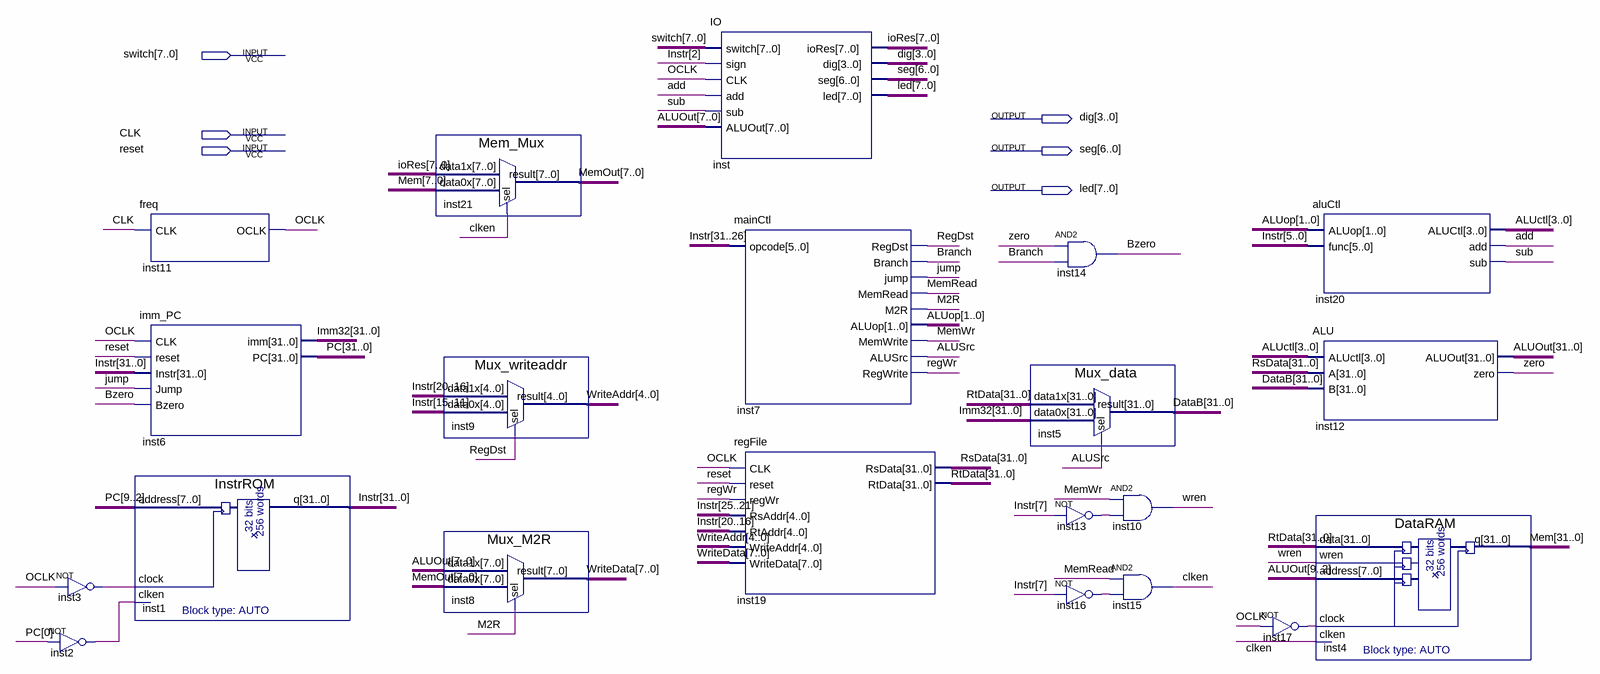
[diagram p0: schematic sheet]
// Quartus schematic SCPU.bdf as structural Verilog: 21 symbols, 6 pins
module SCPU (
  input  [7:0] switch,
  input  CLK,
  input  reset,
  output [3:0] dig,
  output [6:0] seg,
  output [7:0] led
);

  wire add, ALUSrc, Branch, Bzero, clken, inst2_out, inst3_out, inst13_out, inst16_out, inst17_out, jump,
       M2R, MemRead, MemWr, OCLK, RegDst, regWr, sub, wren, zero;
  wire [1:0] ALUop;
  wire [3:0] ALUctl;
  wire [4:0] WriteAddr;
  wire [7:0] ioRes, MemOut, WriteData;
  wire [31:0] ALUOut, DataB, Imm32, Instr, Mem, PC, RsData, RtData;

  not inst3 (inst3_out, OCLK);
  not inst2 (inst2_out, PC[0]);
  freq inst11 (.CLK(CLK), .OCLK(OCLK));
  imm_PC inst6 (.CLK(OCLK), .reset(reset), .Instr(Instr), .Jump(jump), .Bzero(Bzero), .imm(Imm32), .PC(PC));
  InstrROM inst1 (.address(PC[9:2]), .clock(inst3_out), .clken(inst2_out), .q(Instr));
  Mem_Mux inst21 (.data1x(ioRes), .data0x(Mem[7:0]), .sel(clken), .result(MemOut));
  Mux_writeaddr inst9 (.data1x(Instr[20:16]), .data0x(Instr[15:11]), .sel(RegDst), .result(WriteAddr));
  Mux_M2R inst8 (.data1x(ALUOut[7:0]), .data0x(MemOut), .sel(M2R), .result(WriteData));
  IO inst (
    .switch(switch), .sign(Instr[2]), .CLK(OCLK), .add(add), .sub(sub), .ALUOut(ALUOut[7:0]), .ioRes(ioRes),
    .dig(dig), .seg(seg), .led(led));
  mainCtl inst7 (
    .opcode(Instr[31:26]), .RegDst(RegDst), .Branch(Branch), .jump(jump), .MemRead(MemRead), .M2R(M2R),
    .ALUop(ALUop), .MemWrite(MemWr), .ALUSrc(ALUSrc), .RegWrite(regWr));
  regFile inst19 (
    .CLK(OCLK), .reset(reset), .regWr(regWr), .RsAddr(Instr[25:21]), .RtAddr(Instr[20:16]),
    .WriteAddr(WriteAddr), .WriteData(WriteData), .RsData(RsData), .RtData(RtData));
  Mux_data inst5 (.data1x(RtData), .data0x(Imm32), .sel(ALUSrc), .result(DataB));
  and inst14 (Bzero, zero, Branch);
  and inst10 (wren, MemWr, inst13_out);
  not inst13 (inst13_out, Instr[7]);
  and inst15 (clken, MemRead, inst16_out);
  not inst16 (inst16_out, Instr[7]);
  not inst17 (inst17_out, OCLK);
  aluCtl inst20 (.ALUop(ALUop), .func(Instr[5:0]), .ALUCtl(ALUctl), .add(add), .sub(sub));
  ALU inst12 (.ALUctl(ALUctl), .A(RsData), .B(DataB), .ALUOut(ALUOut), .zero(zero));
  DataRAM inst4 (.data(RtData), .wren(wren), .address(ALUOut[9:2]), .clock(inst17_out), .clken(clken), .q(Mem));
endmodule
